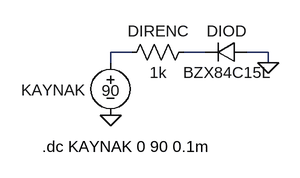
[diagram p0: schematic Draft2.asc]
Draft2.asc, the LTspice schematic file:
Version 4.1
SHEET 1 880 680
WIRE 128 144 96 144
WIRE 240 144 208 144
WIRE 336 144 304 144
WIRE 96 160 96 144
WIRE 336 160 336 144
FLAG 336 160 0
FLAG 96 240 0
SYMBOL diode 304 128 R90
WINDOW 0 0 32 VBottom 2
WINDOW 3 32 32 VTop 2
SYMATTR InstName DIOD
SYMATTR Value BZX84C15L
SYMATTR Description Diode
SYMATTR Type diode
SYMBOL voltage 96 144 R0
WINDOW 0 -136 58 Left 2
WINDOW 3 -13 59 Left 2
WINDOW 123 0 0 Left 0
WINDOW 39 0 0 Left 0
SYMATTR InstName KAYNAK
SYMATTR Value 90
SYMBOL res 112 160 R270
WINDOW 0 32 56 VTop 2
WINDOW 3 0 56 VBottom 2
SYMATTR InstName DIRENC
SYMATTR Value 1k
SYMATTR SpiceLine tol=1 pwr=0.1
TEXT -8 288 Left 2 !.dc KAYNAK 0 90 0.1m

The netlist it stands for:
* Draft2.asc
DIOD 0 N002 BZX84C15L
V§KAYNAK N001 0 90
R§DIRENC N001 N002 1k tol=1 pwr=0.1
.model D D
.lib standard.dio
.dc KAYNAK 0 90 0.1m
.backanno
.end